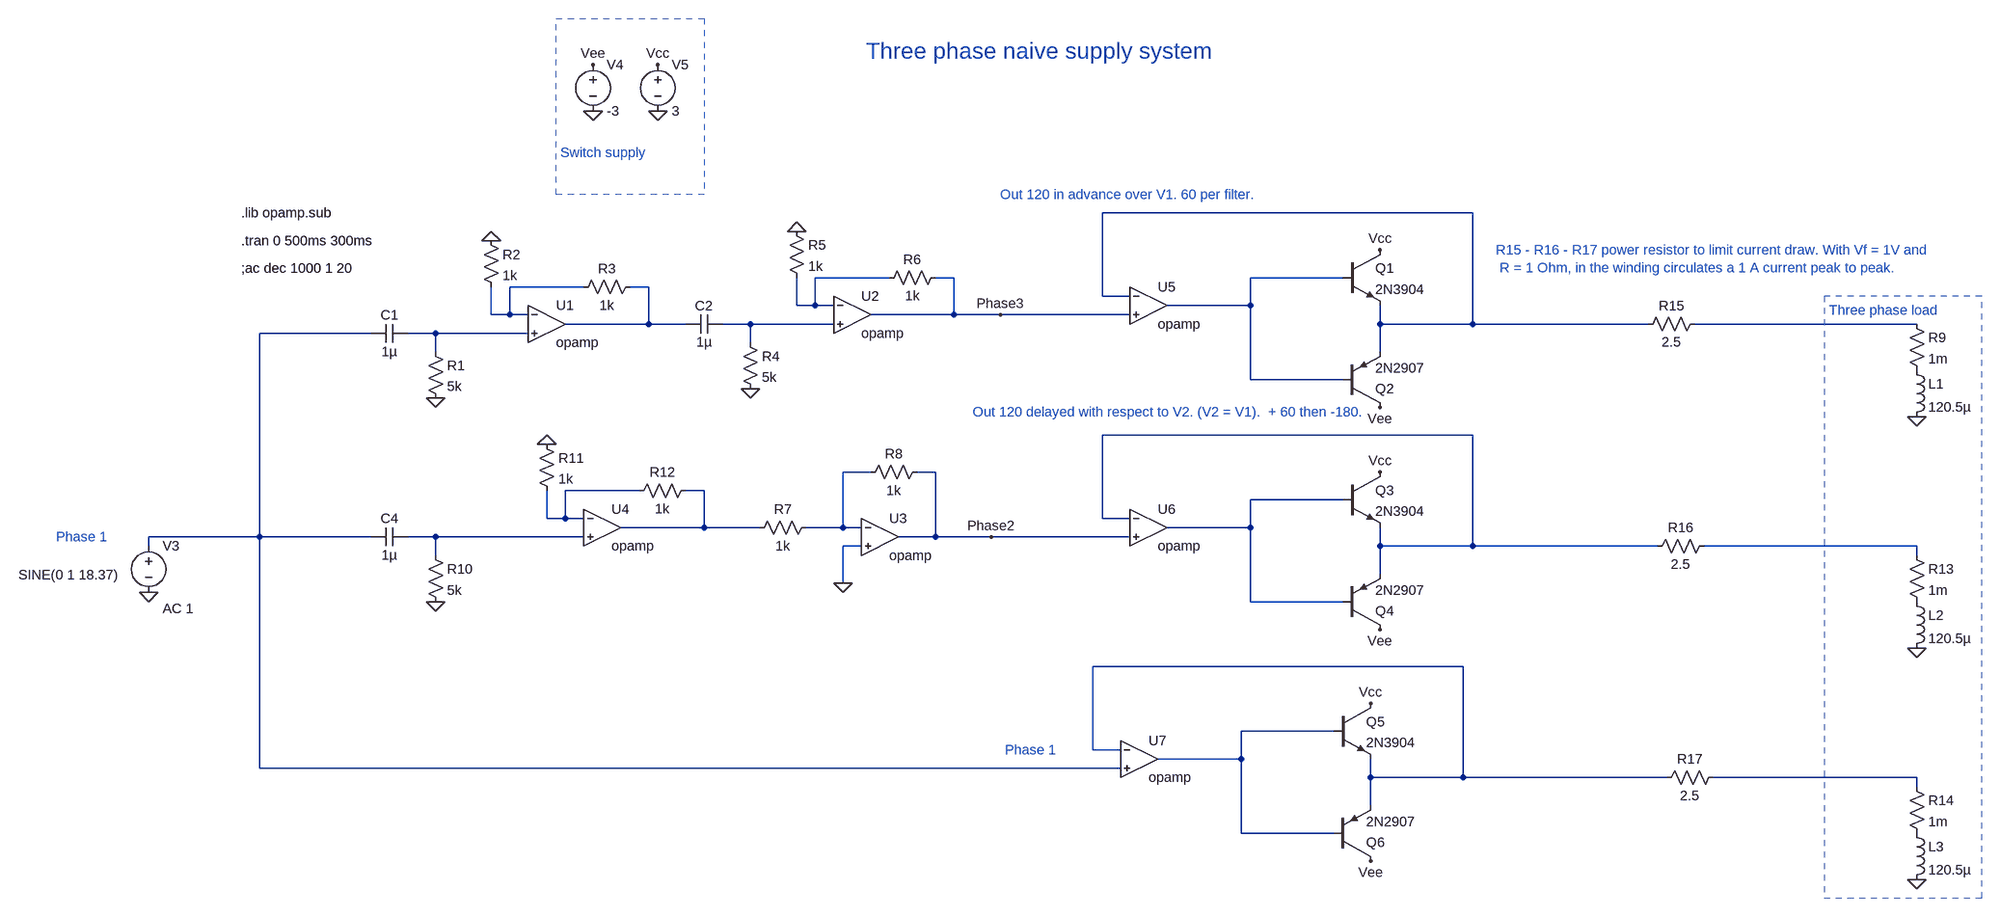
[diagram p0: schematic Three-phase-naive-supply-system.asc]
Three-phase-naive-supply-system.asc, the LTspice schematic file:
Version 4
SHEET 1 3352 1016
WIRE 1920 -192 1280 -192
WIRE 912 -80 784 -80
WIRE 1024 -80 992 -80
WIRE 1696 -80 1536 -80
WIRE 384 -64 256 -64
WIRE 496 -64 464 -64
WIRE 1280 -48 1280 -192
WIRE 1328 -48 1280 -48
WIRE 752 -32 752 -80
WIRE 784 -32 784 -80
WIRE 784 -32 752 -32
WIRE 816 -32 784 -32
WIRE 1536 -32 1536 -80
WIRE 1536 -32 1392 -32
WIRE 224 -16 224 -64
WIRE 256 -16 256 -64
WIRE 256 -16 224 -16
WIRE 288 -16 256 -16
WIRE 1024 -16 1024 -80
WIRE 1024 -16 880 -16
WIRE 1104 -16 1024 -16
WIRE 1328 -16 1104 -16
WIRE 496 0 496 -64
WIRE 496 0 352 0
WIRE 560 0 496 0
WIRE 672 0 624 0
WIRE 816 0 672 0
WIRE 1760 0 1760 -32
WIRE 1920 0 1920 -192
WIRE 1920 0 1760 0
WIRE 2224 0 1920 0
WIRE 2688 0 2304 0
WIRE 16 16 -176 16
WIRE 128 16 80 16
WIRE 288 16 128 16
WIRE 672 32 672 0
WIRE 128 48 128 16
WIRE 1760 48 1760 0
WIRE 1536 96 1536 -32
WIRE 1696 96 1536 96
WIRE 1920 192 1280 192
WIRE 880 256 832 256
WIRE 992 256 960 256
WIRE 480 288 352 288
WIRE 592 288 560 288
WIRE 1696 304 1536 304
WIRE 320 336 320 288
WIRE 352 336 352 288
WIRE 352 336 320 336
WIRE 384 336 352 336
WIRE 1280 336 1280 192
WIRE 1328 336 1280 336
WIRE 592 352 592 288
WIRE 592 352 448 352
WIRE 688 352 592 352
WIRE 832 352 832 256
WIRE 832 352 768 352
WIRE 864 352 832 352
WIRE 1536 352 1536 304
WIRE 1536 352 1392 352
WIRE -176 368 -176 16
WIRE -176 368 -368 368
WIRE 16 368 -176 368
WIRE 128 368 80 368
WIRE 384 368 128 368
WIRE 992 368 992 256
WIRE 992 368 928 368
WIRE 1088 368 992 368
WIRE 1328 368 1088 368
WIRE -368 384 -368 368
WIRE 864 384 832 384
WIRE 1760 384 1760 352
WIRE 1920 384 1920 192
WIRE 1920 384 1760 384
WIRE 2240 384 1920 384
WIRE 2688 384 2320 384
WIRE 128 400 128 368
WIRE 2688 400 2688 384
WIRE 1760 432 1760 384
WIRE 832 448 832 384
WIRE 1536 480 1536 352
WIRE 1696 480 1536 480
WIRE 1904 592 1264 592
WIRE 1680 704 1520 704
WIRE 1264 736 1264 592
WIRE 1312 736 1264 736
WIRE 1520 752 1520 704
WIRE 1520 752 1376 752
WIRE -176 768 -176 368
WIRE 1312 768 -176 768
WIRE 1744 784 1744 752
WIRE 1904 784 1904 592
WIRE 1904 784 1744 784
WIRE 2256 784 1904 784
WIRE 2688 784 2336 784
WIRE 2688 800 2688 784
WIRE 1744 832 1744 784
WIRE 1520 880 1520 752
WIRE 1680 880 1520 880
FLAG 128 128 0
FLAG 224 -144 0
FLAG 672 112 0
FLAG 752 -160 0
FLAG 128 480 0
FLAG 320 208 0
FLAG 832 448 0
FLAG 2688 160 0
FLAG 1104 -16 Phase3
FLAG 2688 560 0
FLAG 1088 368 Phase2
FLAG -368 464 0
FLAG 2688 960 0
FLAG 512 -368 0
FLAG 512 -448 Vcc
FLAG 400 -368 0
FLAG 400 -448 Vee
FLAG 1760 144 Vee
FLAG 1760 528 Vee
FLAG 1744 928 Vee
FLAG 1760 -128 Vcc
FLAG 1760 256 Vcc
FLAG 1744 656 Vcc
SYMBOL cap 80 0 R90
WINDOW 0 0 32 VBottom 2
WINDOW 3 32 32 VTop 2
SYMATTR InstName C1
SYMATTR Value 1µ
SYMBOL res 112 32 R0
SYMATTR InstName R1
SYMATTR Value 5k
SYMBOL Opamps\\opamp 320 -64 R0
SYMATTR InstName U1
SYMBOL res 208 -160 R0
SYMATTR InstName R2
SYMATTR Value 1k
SYMBOL res 480 -80 R90
WINDOW 0 0 56 VBottom 2
WINDOW 3 32 56 VTop 2
SYMATTR InstName R3
SYMATTR Value 1k
SYMBOL cap 624 -16 R90
WINDOW 0 0 32 VBottom 2
WINDOW 3 32 32 VTop 2
SYMATTR InstName C2
SYMATTR Value 1µ
SYMBOL res 656 16 R0
SYMATTR InstName R4
SYMATTR Value 5k
SYMBOL Opamps\\opamp 848 -80 R0
SYMATTR InstName U2
SYMBOL res 736 -176 R0
SYMATTR InstName R5
SYMATTR Value 1k
SYMBOL res 1008 -96 R90
WINDOW 0 0 56 VBottom 2
WINDOW 3 32 56 VTop 2
SYMATTR InstName R6
SYMATTR Value 1k
SYMBOL Opamps\\opamp 896 304 R0
SYMATTR InstName U3
SYMBOL cap 80 352 R90
WINDOW 0 0 32 VBottom 2
WINDOW 3 32 32 VTop 2
SYMATTR InstName C4
SYMATTR Value 1µ
SYMBOL res 112 384 R0
SYMATTR InstName R10
SYMATTR Value 5k
SYMBOL Opamps\\opamp 416 288 R0
SYMATTR InstName U4
SYMBOL res 304 192 R0
SYMATTR InstName R11
SYMATTR Value 1k
SYMBOL res 576 272 R90
WINDOW 0 0 56 VBottom 2
WINDOW 3 32 56 VTop 2
SYMATTR InstName R12
SYMATTR Value 1k
SYMBOL res 784 336 R90
WINDOW 0 0 56 VBottom 2
WINDOW 3 32 56 VTop 2
SYMATTR InstName R7
SYMATTR Value 1k
SYMBOL res 976 240 R90
WINDOW 0 0 56 VBottom 2
WINDOW 3 32 56 VTop 2
SYMATTR InstName R8
SYMATTR Value 1k
SYMBOL res 2672 -16 R0
SYMATTR InstName R9
SYMATTR Value 1m
SYMBOL ind 2672 64 R0
SYMATTR InstName L1
SYMATTR Value 120.5µ
SYMBOL res 2672 384 R0
SYMATTR InstName R13
SYMATTR Value 1m
SYMBOL ind 2672 464 R0
SYMATTR InstName L2
SYMATTR Value 120.5µ
SYMBOL voltage -368 368 R0
WINDOW 3 -225 66 Left 2
WINDOW 123 24 124 Left 2
WINDOW 39 0 0 Left 2
SYMATTR Value SINE(0 1 18.37)
SYMATTR Value2 AC 1
SYMATTR InstName V3
SYMBOL res 2672 784 R0
SYMATTR InstName R14
SYMATTR Value 1m
SYMBOL ind 2672 864 R0
SYMATTR InstName L3
SYMATTR Value 120.5µ
SYMBOL res 2208 16 R270
WINDOW 0 32 56 VTop 2
WINDOW 3 0 56 VBottom 2
SYMATTR InstName R15
SYMATTR Value 2.5
SYMBOL res 2224 400 R270
WINDOW 0 32 56 VTop 2
WINDOW 3 0 56 VBottom 2
SYMATTR InstName R16
SYMATTR Value 2.5
SYMBOL res 2240 800 R270
WINDOW 0 32 56 VTop 2
WINDOW 3 0 56 VBottom 2
SYMATTR InstName R17
SYMATTR Value 2.5
SYMBOL voltage 512 -464 R0
WINDOW 123 0 0 Left 2
WINDOW 39 0 0 Left 2
SYMATTR InstName V5
SYMATTR Value 3
SYMBOL npn 1696 -128 R0
SYMATTR InstName Q1
SYMATTR Value 2N3904
SYMBOL Opamps\\opamp 1360 -96 R0
SYMATTR InstName U5
SYMBOL voltage 400 -464 R0
WINDOW 123 0 0 Left 2
WINDOW 39 0 0 Left 2
SYMATTR InstName V4
SYMATTR Value -3
SYMBOL pnp 1696 144 M180
SYMATTR InstName Q2
SYMATTR Value 2N2907
SYMBOL npn 1696 256 R0
SYMATTR InstName Q3
SYMATTR Value 2N3904
SYMBOL Opamps\\opamp 1360 288 R0
SYMATTR InstName U6
SYMBOL pnp 1696 528 M180
SYMATTR InstName Q4
SYMATTR Value 2N2907
SYMBOL npn 1680 656 R0
SYMATTR InstName Q5
SYMATTR Value 2N3904
SYMBOL Opamps\\opamp 1344 688 R0
SYMATTR InstName U7
SYMBOL pnp 1680 928 M180
SYMATTR InstName Q6
SYMATTR Value 2N2907
TEXT -208 -96 Left 2 !;ac dec 1000 1 20
TEXT -208 -192 Left 2 !.lib opamp.sub
TEXT -208 -144 Left 2 !.tran 0 500ms 300ms
TEXT 1104 -224 Left 2 ;Out 120 in advance over V1. 60 per filter.
TEXT 1056 152 Left 2 ;Out 120 delayed with respect to V2. (V2 = V1).  + 60 then -180.
TEXT 872 -472 Left 4 ;Three phase naive supply system
TEXT -528 368 Left 2 ;Phase 1
TEXT 1112 736 Left 2 ;Phase 1
TEXT 1960 -128 Left 2 ;R15 - R16 - R17 power resistor to limit current draw. With Vf = 1V and\n R = 1 Ohm, in the winding circulates a 1 A current peak to peak.
TEXT 344 -296 Left 2 ;Switch supply
TEXT 2536 -24 Left 2 ;Three phase load
RECTANGLE Normal 2528 992 2800 -48 2
RECTANGLE Normal 592 -224 336 -528 2

The netlist it stands for:
* Three-phase-naive-supply-system.asc
C1 N009 N008 1µ
R1 N009 0 5k
XU1 N004 N009 N005 opamp Aol=100K GBW=10Meg  ; pins invin noninvin out
R2 0 N004 1k
R3 N005 N004 1k
C2 N006 N005 1µ
R4 N006 0 5k
XU2 N002 N006 Phase3 opamp Aol=100K GBW=10Meg  ; pins invin noninvin out
R5 0 N002 1k
R6 Phase3 N002 1k
XU3 N011 0 Phase2 opamp Aol=100K GBW=10Meg  ; pins invin noninvin out
C4 N015 N008 1µ
R10 N015 0 5k
XU4 N012 N015 N013 opamp Aol=100K GBW=10Meg  ; pins invin noninvin out
R11 0 N012 1k
R12 N013 N012 1k
R7 N011 N013 1k
R8 Phase2 N011 1k
R9 N007 P001 1m
L1 P001 0 120.5µ
R13 N016 P002 1m
L2 P002 0 120.5µ
V3 N008 0 SINE(0 1 18.37) AC 1
R14 N019 P003 1m
L3 P003 0 120.5µ
R15 N001 N007 2.5
R16 N010 N016 2.5
R17 N017 N019 2.5
V5 Vcc 0 3
Q1 Vcc N003 N001 0 2N3904
XU5 N001 Phase3 N003 opamp Aol=100K GBW=10Meg  ; pins invin noninvin out
V4 Vee 0 -3
Q2 Vee N003 N001 0 2N2907
Q3 Vcc N014 N010 0 2N3904
XU6 N010 Phase2 N014 opamp Aol=100K GBW=10Meg  ; pins invin noninvin out
Q4 Vee N014 N010 0 2N2907
Q5 Vcc N018 N017 0 2N3904
XU7 N017 N008 N018 opamp Aol=100K GBW=10Meg  ; pins invin noninvin out
Q6 Vee N018 N017 0 2N2907
.model NPN NPN
.model PNP PNP
.lib standard.bjt
;ac dec 1000 1 20
.lib opamp.sub
.tran 0 500ms 300ms
* Out 120 in advance over V1. 60 per filter.
* Out 120 delayed with respect to V2. (V2 = V1).  + 60 then -180.
* Three phase naive supply system
* Phase 1
* Phase 1
* R15 - R16 - R17 power resistor to limit current draw. With Vf = 1V and
*  R = 1 Ohm, in the winding circulates a 1 A current peak to peak.
* Switch supply
* Three phase load
.backanno
.end